# EAGLE design electrotactile_adapter (EAGLE 9.1.3)
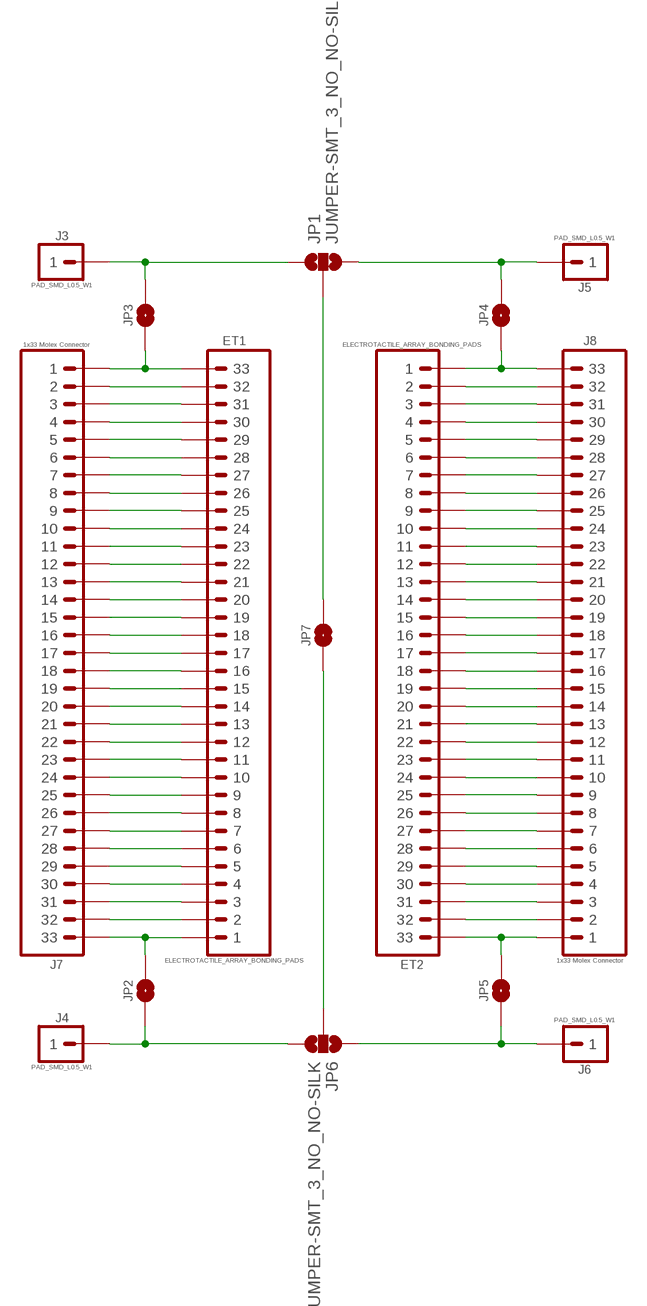
[diagram p0: schematic, sheet 1]

## Parts
ET1  ELECTROTACTILE_ARRAY_BONDING_PADS  [ELECTROTACTILE_ARRAY_BONDING_PADS]
ET2  ELECTROTACTILE_ARRAY_BONDING_PADS  [ELECTROTACTILE_ARRAY_BONDING_PADS]
J3  PAD_SMD_L0.5_W1  [1X01_SMD_L0.5-W1]
J4  PAD_SMD_L0.5_W1  [1X01_SMD_L0.5-W1]
J5  PAD_SMD_L0.5_W1  [1X01_SMD_L0.5-W1]
J6  PAD_SMD_L0.5_W1  [1X01_SMD_L0.5-W1]
J7  1x33 Molex Connector  1X33_MOLEX_FPC_FPC_RIBBON-CABLE  [_MOLEX-5025983393_FPC_PITCH-0.3MM]
J8  1x33 Molex Connector  1X33_MOLEX_FPC_FPC_RIBBON-CABLE  [_MOLEX-5025983393_FPC_PITCH-0.3MM]
JP1  JUMPER-SMT_3_NO_NO-SILK  [SMT-JUMPER_3_NO_NO-SILK]
JP2  JUMPER_SMD_2-PAD_NO_SILK  [SMT-JUMPER_2_NO_SILK]
JP3  JUMPER_SMD_2-PAD_NO_SILK  [SMT-JUMPER_2_NO_SILK]
JP4  JUMPER_SMD_2-PAD_NO_SILK  [SMT-JUMPER_2_NO_SILK]
JP5  JUMPER_SMD_2-PAD_NO_SILK  [SMT-JUMPER_2_NO_SILK]
JP6  JUMPER-SMT_3_NO_NO-SILK  [SMT-JUMPER_3_NO_NO-SILK]
JP7  JUMPER_SMD_2-PAD_NO_SILK  [SMT-JUMPER_2_NO_SILK]

## Nets
N$1: ET2.P$19 J8.P$15
N$2: ET2.P$2 J8.P$32
N$3: ET2.P$3 J8.P$31
N$4: ET2.P$4 J8.P$30
N$5: ET2.P$5 J8.P$29
N$6: ET2.P$6 J8.P$28
N$7: ET2.P$7 J8.P$27
N$8: ET2.P$8 J8.P$26
N$9: ET2.P$9 J8.P$25
N$10: ET2.P$10 J8.P$24
N$11: ET2.P$11 J8.P$23
N$12: ET2.P$12 J8.P$22
N$13: ET2.P$13 J8.P$21
N$14: ET2.P$1 J8.P$33 JP4.1
N$15: ET2.P$14 J8.P$20
N$16: ET2.P$16 J8.P$18
N$17: ET2.P$17 J8.P$17
N$18: ET2.P$18 J8.P$16
N$19: ET2.P$15 J8.P$19
N$20: ET2.P$20 J8.P$14
N$21: ET2.P$21 J8.P$13
N$22: ET2.P$22 J8.P$12
N$23: ET2.P$24 J8.P$10
N$24: ET2.P$25 J8.P$9
N$25: ET2.P$26 J8.P$8
N$26: ET2.P$27 J8.P$7
N$27: ET2.P$28 J8.P$6
N$28: ET2.P$29 J8.P$5
N$29: ET2.P$30 J8.P$4
N$30: ET2.P$31 J8.P$3
N$31: ET2.P$32 J8.P$2
N$33: ET2.P$33 J8.P$1 JP5.2
N$34: J5.P$1 JP1.3 JP4.2
N$35: ET1.P$32 J7.P$2
N$36: ET1.P$31 J7.P$3
N$37: ET1.P$30 J7.P$4
N$38: ET1.P$29 J7.P$5
N$39: ET1.P$28 J7.P$6
N$40: ET1.P$27 J7.P$7
N$41: ET1.P$26 J7.P$8
N$42: ET1.P$25 J7.P$9
N$43: ET1.P$24 J7.P$10
N$44: ET1.P$23 J7.P$11
N$45: ET1.P$22 J7.P$12
N$46: ET1.P$21 J7.P$13
N$47: ET1.P$20 J7.P$14
N$48: ET1.P$1 J7.P$33 JP2.2
N$49: ET1.P$19 J7.P$15
N$50: ET1.P$18 J7.P$16
N$51: ET1.P$17 J7.P$17
N$52: ET1.P$16 J7.P$18
N$53: ET1.P$15 J7.P$19
N$54: ET1.P$14 J7.P$20
N$55: ET1.P$13 J7.P$21
N$56: ET1.P$11 J7.P$23
N$57: ET1.P$12 J7.P$22
N$58: ET1.P$10 J7.P$24
N$59: ET1.P$9 J7.P$25
N$60: ET1.P$8 J7.P$26
N$61: ET1.P$7 J7.P$27
N$62: ET1.P$6 J7.P$28
N$63: ET1.P$5 J7.P$29
N$64: ET1.P$4 J7.P$30
N$65: ET1.P$3 J7.P$31
N$66: ET1.P$2 J7.P$32
N$67: ET1.P$33 J7.P$1 JP3.1
N$68: J3.P$1 JP1.1 JP3.2
N$69: J6.P$1 JP5.1 JP6.1
N$70: J4.P$1 JP2.1 JP6.3
N$71: JP6.2 JP7.1
N$72: JP1.2 JP7.2
N$99: ET2.P$23 J8.P$11

## Library data of the parts
ET1 ET2 = lipomi:ELECTROTACTILE_ARRAY_BONDING_PADS
J3-J6 = PiB_connectors:PAD_SMD
J7 J8 = PiB_connectors:1X33_MOLEX_FPC; DATASHEET: https://www.molex.com/pdm_docs/sd/5025982593_sd.pdf; DATASHEET_CABLE: https://www.molex.com/pdm_docs/sd/150150423_sd.pdf; DIST: Digikey; DISTLINK: https://www.digikey.com/products/en?keywords=WM9775CT-ND; DISTLINK_CABLE: https://www.digikey.com/products/en?keywords=WM9647-ND; DISTPN: WM9775CT-ND; DISTPN_CABLE: WM9647-ND; DIST_CABLE: Digikey; MFR: Molex, LLC; MFR_CABLE: Molex, LLC; MPN: 5025983393; MPN_CABLE: 0150150233
JP1 JP6 = PiB_connectors:JUMPER-SMT_3_NO: Normally open jumper This jumper has three pads in close proximity to each other. Apply solder to close the connection(s).
JP2-JP5 JP7 = PiB_connectors:JUMPER_SMD_2-PAD_NO: Normally open jumper

## Board
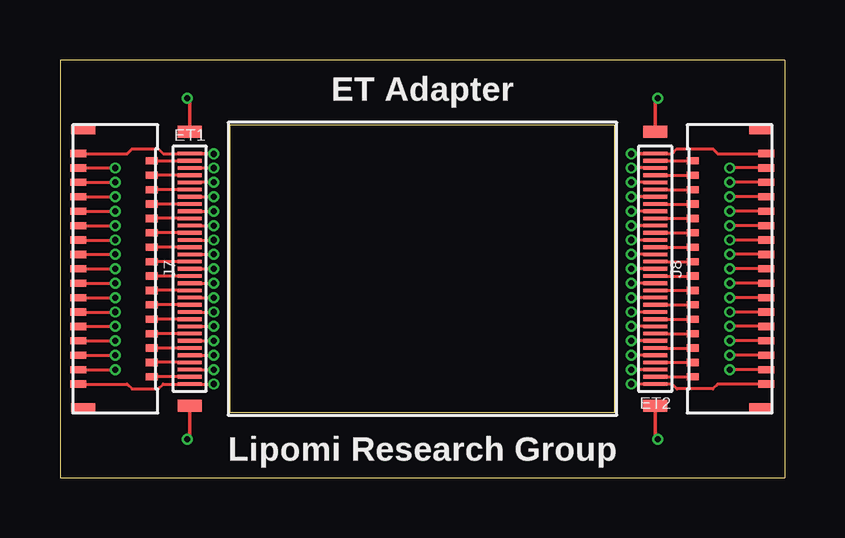
[diagram p1: board, top side]
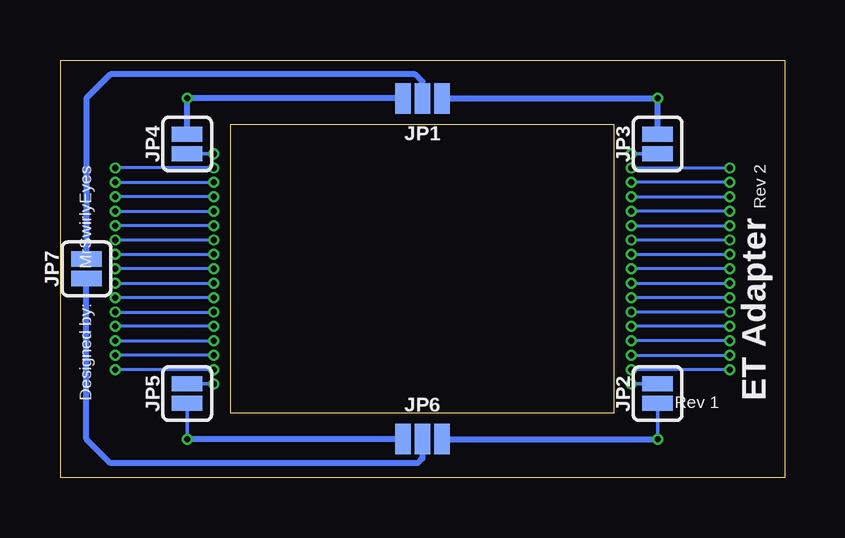
[diagram p2: board, bottom side, seen from below]

Size 30.2 x 17.4 mm. Coordinates in mm from the lower left corner, seen from the top.
Outline: 0,0 30.2,0 30.2,17.4 0,17.4 0,0
Copper layers (1*2*15*16): Top 0.035559375mm / dielectric 0.17018125mm / Route2 0.01778125mm / dielectric 47mil / Route15 0.01778125mm / dielectric 0.17018125mm / Bottom 0.035559375mm
Design rules "oshpark-4layer": minimum track width 5mil, minimum drill 10mil, track to track 5mil, track to pad 5mil, pad to pad 5mil, via to via 5mil, smd to smd 5mil, copper to edge 15mil, drill to drill 6mil, minimum pad ring 4mil, minimum via ring 4mil, stop-mask expansion 2.5mil, vias tented up to drill 0mil, thermal gap 10mil

### Footprints (pad centres in the part's own frame; a part is rotated, then mirrored left to right if it is on the bottom)
ELECTROTACTILE_ARRAY_BONDING_PADS = smd 0.152 x 1: P$1 -4.8,0; P$2 -4.5,0; P$3 -4.2,0; P$4 -3.9,0; P$5 -3.6,0; P$6 -3.3,0; P$7 -3,0; P$8 -2.7,0; P$9 -2.4,0; P$10 -2.1,0; P$11 -1.8,0; P$12 -1.5,0; P$13 -1.2,0; P$14 -0.9,0; P$15 -0.6,0; P$16 -0.3,0; P$17 0,0; P$18 0.3,0; P$19 0.6,0; P$20 0.9,0; P$21 1.2,0; P$22 1.5,0; P$23 1.8,0; P$24 2.1,0; P$25 2.4,0; P$26 2.7,0; P$27 3,0; P$28 3.3,0; P$29 3.6,0; P$30 3.9,0; P$31 4.2,0; P$32 4.5,0; P$33 4.8,0
1X01_SMD_L0.5-W1 = smd 0.5 x 1: P$1 0,0
_MOLEX-5025983393_FPC_PITCH-0.3MM = smd 0.3 x 0.67: P$1 -4.8,-1.532; P$3 -4.2,-1.532; P$5 -3.6,-1.532; P$7 -3,-1.532; P$9 -2.4,-1.532; P$11 -1.8,-1.532; P$13 -1.2,-1.532; P$15 -0.6,-1.532; P$17 0,-1.532; P$19 0.6,-1.532; P$21 1.2,-1.532; P$23 1.8,-1.532; P$25 2.4,-1.532; P$27 3,-1.532; P$29 3.6,-1.532; P$31 4.2,-1.532; P$33 4.8,-1.532 | smd 0.3 x 0.5: P$2 -4.5,1.532; P$4 -3.9,1.532; P$6 -3.3,1.532; P$8 -2.7,1.532; P$10 -2.1,1.532; P$12 -1.5,1.532; P$14 -0.9,1.532; P$16 -0.3,1.532; P$18 0.3,1.532; P$20 0.9,1.532; P$22 1.5,1.532; P$24 2.1,1.532; P$26 2.7,1.532; P$28 3.3,1.532; P$30 3.9,1.532; P$32 4.5,1.532 | smd 0.35 x 1: P$34 -5.775,-1.325; P$35 5.775,-1.325
SMT-JUMPER_3_NO_NO-SILK = smd 0.635 x 1.27: 1 -0.813,0; 2 0,0; 3 0.813,0
SMT-JUMPER_2_NO_SILK = smd 0.635 x 1.27: 1 -0.406,0; 2 0.406,0

### Placement (x,y rotation side)
ET1  5.4,8.7 90 top
ET2  24.8,8.7 270 top
J3  5.4,14.4 90 top
J4  5.4,3 90 top
J5  24.8,14.4 90 top
J6  24.8,3 90 top
J7  2.3,8.7 270 top
J8  27.9,8.7 90 top
JP1  15.1,15.8 180 bottom
JP2  5.3,3.5 90 bottom
JP3  5.3,13.9 90 bottom
JP4  24.9,13.9 90 bottom
JP5  24.9,3.5 90 bottom
JP6  15.1,1.6 0 bottom
JP7  29.1,8.7 90 bottom
U$1  [ELECTROTACTILE_SUBSTRATE]  15.1,8.7 0 top

### Tracks (layer width: path | path; a pad name or v marks a point on that pad's centre or on a via)
N$1  (via drill 0.25)
  Top 0.127: ET2.P$19 v23.8,8.1 | J8.P$15 v27.9,8.1
  Bottom 0.127: v27.9,8.1 v23.8,8.1
N$2
  Top 0.127: ET2.P$2 J8.P$32
N$3  (via drill 0.25)
  Top 0.127: ET2.P$3 v23.8,12.9 | J8.P$31 v27.9,12.9
  Bottom 0.127: v23.8,12.9 v27.9,12.9
N$4
  Top 0.127: ET2.P$4 J8.P$30
N$5  (via drill 0.25)
  Top 0.127: ET2.P$5 v23.8,12.3 | J8.P$29 v27.9,12.3
  Bottom 0.127: v27.9,12.3 v23.8,12.3
N$6
  Top 0.127: ET2.P$6 J8.P$28
N$7  (via drill 0.25)
  Top 0.127: ET2.P$7 v23.8,11.7 | J8.P$27 v27.9,11.7
  Bottom 0.127: v23.8,11.7 v27.9,11.7
N$8
  Top 0.127: ET2.P$8 J8.P$26
N$9  (via drill 0.25)
  Top 0.127: ET2.P$9 v23.8,11.1 | J8.P$25 v27.9,11.1
  Bottom 0.127: v27.9,11.1 v23.8,11.1
N$10
  Top 0.127: ET2.P$10 J8.P$24
N$11  (via drill 0.25)
  Top 0.127: ET2.P$11 v23.8,10.5 | J8.P$23 v27.9,10.5
  Bottom 0.127: v23.8,10.5 v27.9,10.5
N$12
  Top 0.127: ET2.P$12 J8.P$22
N$13  (via drill 0.25)
  Top 0.127: ET2.P$13 v23.8,9.9 | J8.P$21 v27.9,9.9
  Bottom 0.127: v23.8,9.9 v27.9,9.9
N$14  (via drill 0.25)
  Top 0.127: ET2.P$1 25.5,13.5 25.7,13.7 27.2,13.7 27.4,13.5 J8.P$33
  Top 0.152: ET2.P$1 23.82,13.5 v23.8,13.48
  Bottom 0.152: JP4.1 23.81,13.49 v23.8,13.48
N$15
  Top 0.127: ET2.P$14 J8.P$20
N$16
  Top 0.127: ET2.P$16 J8.P$18
N$17  (via drill 0.25)
  Top 0.127: ET2.P$17 v23.8,8.7 | J8.P$17 v27.9,8.7
  Bottom 0.127: v23.8,8.7 v27.9,8.7
N$18
  Top 0.127: ET2.P$18 J8.P$16
N$19  (via drill 0.25)
  Top 0.127: ET2.P$15 v23.8,9.3 | J8.P$19 v27.9,9.3
  Bottom 0.127: v27.9,9.3 v23.8,9.3
N$20
  Top 0.127: ET2.P$20 J8.P$14
N$21  (via drill 0.25)
  Top 0.127: ET2.P$21 v23.8,7.5 | J8.P$13 v27.9,7.5
  Bottom 0.127: v23.8,7.5 v27.9,7.5
N$22
  Top 0.127: ET2.P$22 J8.P$12
N$23
  Top 0.127: ET2.P$24 J8.P$10
N$24  (via drill 0.25)
  Top 0.127: ET2.P$25 v23.8,6.3 | J8.P$9 v27.9,6.3
  Bottom 0.127: v23.8,6.3 v27.9,6.3
N$25
  Top 0.127: ET2.P$26 J8.P$8
N$26  (via drill 0.25)
  Top 0.127: ET2.P$27 v23.8,5.7 | J8.P$7 v27.9,5.7
  Bottom 0.127: v27.9,5.7 v23.8,5.7
N$27
  Top 0.127: ET2.P$28 J8.P$6
N$28  (via drill 0.25)
  Top 0.127: ET2.P$29 v23.8,5.1 | J8.P$5 v27.9,5.1
  Bottom 0.127: v23.8,5.1 v27.9,5.1
N$29
  Top 0.127: ET2.P$30 J8.P$4
N$30  (via drill 0.25)
  Top 0.127: ET2.P$31 v23.8,4.5 | J8.P$3 v27.9,4.5
  Bottom 0.127: v23.8,4.5 v27.9,4.5
N$31
  Top 0.127: ET2.P$32 J8.P$2
N$33  (via drill 0.25)
  Top 0.127: J8.P$1 27.4,3.9 27.2,3.7 25.7,3.7 25.5,3.9 ET2.P$33 v23.8,3.9
  Bottom 0.152: JP5.2 v23.81,3.91 v23.8,3.9
N$34  (via drill 0.25)
  Top 0.152: J5.P$1 24.8,15.7 v24.9,15.8
  Bottom 0.254: JP1.3 v24.9,15.8 24.9,15.7 JP4.2
N$35
  Top 0.127: J7.P$2 ET1.P$32
N$36  (via drill 0.25)
  Top 0.127: J7.P$3 v2.3,12.9 | ET1.P$31 v6.4,12.9
  Bottom 0.127: v6.4,12.9 v2.3,12.9
N$37
  Top 0.127: ET1.P$30 J7.P$4
N$38  (via drill 0.25)
  Top 0.127: J7.P$5 v2.3,12.3 | v6.4,12.3 ET1.P$29
  Bottom 0.127: v2.3,12.3 v6.4,12.3
N$39
  Top 0.127: ET1.P$28 J7.P$6
N$40  (via drill 0.25)
  Top 0.127: J7.P$7 v2.3,11.7 | ET1.P$27 v6.4,11.7
  Bottom 0.127: v6.4,11.7 v2.3,11.7
N$41
  Top 0.127: ET1.P$26 J7.P$8
N$42  (via drill 0.25)
  Top 0.127: J7.P$9 v2.3,11.1 | ET1.P$25 v6.4,11.1
  Bottom 0.127: v2.3,11.1 v6.4,11.1
N$43
  Top 0.127: ET1.P$24 J7.P$10
N$44  (via drill 0.25)
  Top 0.127: J7.P$11 v2.3,10.5 | ET1.P$23 v6.4,10.5
  Bottom 0.127: v6.4,10.5 v2.3,10.5
N$45
  Top 0.127: ET1.P$22 J7.P$12
N$46  (via drill 0.25)
  Top 0.127: J7.P$13 v2.3,9.9 | ET1.P$21 v6.4,9.9
  Bottom 0.127: v2.3,9.9 v6.4,9.9
N$47
  Top 0.127: ET1.P$20 J7.P$14
N$48  (via drill 0.25)
  Top 0.127: J7.P$33 2.8,3.9 3,3.7 4.1,3.7 4.3,3.9 ET1.P$1 v6.4,3.9
  Bottom 0.152: JP2.2 v6.39,3.91 v6.4,3.9
N$49  (via drill 0.25)
  Top 0.127: J7.P$15 v2.3,9.3 | ET1.P$19 v6.4,9.3
  Bottom 0.127: v6.4,9.3 v2.3,9.3
N$50
  Top 0.127: ET1.P$18 J7.P$16
N$51  (via drill 0.25)
  Top 0.127: J7.P$17 v2.3,8.7 | ET1.P$17 v6.4,8.7
  Bottom 0.127: v2.3,8.7 v6.4,8.7
N$52
  Top 0.127: ET1.P$16 J7.P$18
N$53  (via drill 0.25)
  Top 0.127: J7.P$19 v2.3,8.1 | ET1.P$15 v6.4,8.1
  Bottom 0.127: v6.4,8.1 v2.3,8.1
N$54
  Top 0.127: ET1.P$14 J7.P$20
N$55  (via drill 0.25)
  Top 0.127: J7.P$21 v2.3,7.5 | ET1.P$13 v6.4,7.5
  Bottom 0.127: v2.3,7.5 v6.4,7.5
N$56  (via drill 0.25)
  Top 0.127: J7.P$23 v2.3,6.9 | ET1.P$11 v6.4,6.9
  Bottom 0.127: v2.3,6.9 v6.4,6.9
N$57
  Top 0.127: ET1.P$12 J7.P$22
N$58
  Top 0.127: ET1.P$10 J7.P$24
N$59  (via drill 0.25)
  Top 0.127: J7.P$25 v2.3,6.3 | ET1.P$9 v6.4,6.3
  Bottom 0.127: v2.3,6.3 v6.4,6.3
N$60
  Top 0.127: ET1.P$8 J7.P$26
N$61  (via drill 0.25)
  Top 0.127: J7.P$27 v2.3,5.7 | ET1.P$7 v6.4,5.7
  Bottom 0.127: v2.3,5.7 v6.4,5.7
N$62
  Top 0.127: ET1.P$6 J7.P$28
N$63  (via drill 0.25)
  Top 0.127: J7.P$29 v2.3,5.1 | ET1.P$5 v6.4,5.1
  Bottom 0.127: v6.4,5.1 v2.3,5.1
N$64
  Top 0.127: ET1.P$4 J7.P$30
N$65  (via drill 0.25)
  Top 0.127: J7.P$31 v2.3,4.5 | ET1.P$3 v6.4,4.5
  Bottom 0.127: v2.3,4.5 6.3,4.5 v6.4,4.5
N$66
  Top 0.127: ET1.P$2 J7.P$32
N$67  (via drill 0.25)
  Top 0.127: J7.P$1 2.8,13.5 3,13.7 4.1,13.7 4.3,13.5 ET1.P$33
  Top 0.152: ET1.P$33 6.38,13.5 v6.4,13.48
  Bottom 0.152: JP3.1 6.39,13.49 v6.4,13.48
N$68  (via drill 0.25)
  Top 0.152: J3.P$1 5.4,15.7 v5.3,15.8
  Bottom 0.254: JP1.1 v5.3,15.8 JP3.2
N$69  (via drill 0.25)
  Top 0.152: J6.P$1 24.8,1.7 v24.9,1.6
  Bottom 0.152: JP5.1 v24.9,1.6
  Bottom 0.254: JP6.1 v24.9,1.6
N$70  (via drill 0.25)
  Top 0.152: J4.P$1 5.4,1.7 v5.3,1.6
  Bottom 0.152: JP2.1 v5.3,1.6
  Bottom 0.254: JP6.3 v5.3,1.6
N$71
  Bottom 0.254: JP7.1 29.1,1.6 28.1,0.6 15.3,0.6 15.1,0.8 JP6.2
N$72
  Bottom 0.254: JP1.2 15.1,16.5 15.4,16.8 28.1,16.8 29.1,15.8 JP7.2
N$99  (via drill 0.25)
  Top 0.127: ET2.P$23 v23.8,6.9 | J8.P$11 v27.9,6.9
  Bottom 0.127: v27.9,6.9 v23.8,6.9

### Text on the board
tPlace: ET Adapter | Lipomi Research Group
bPlace: Rev 2 | MrSwirlyEyes | ET Adapter | Rev 1 | Designed by: